# Altium project Carte_Alim_2020.PrjPcb
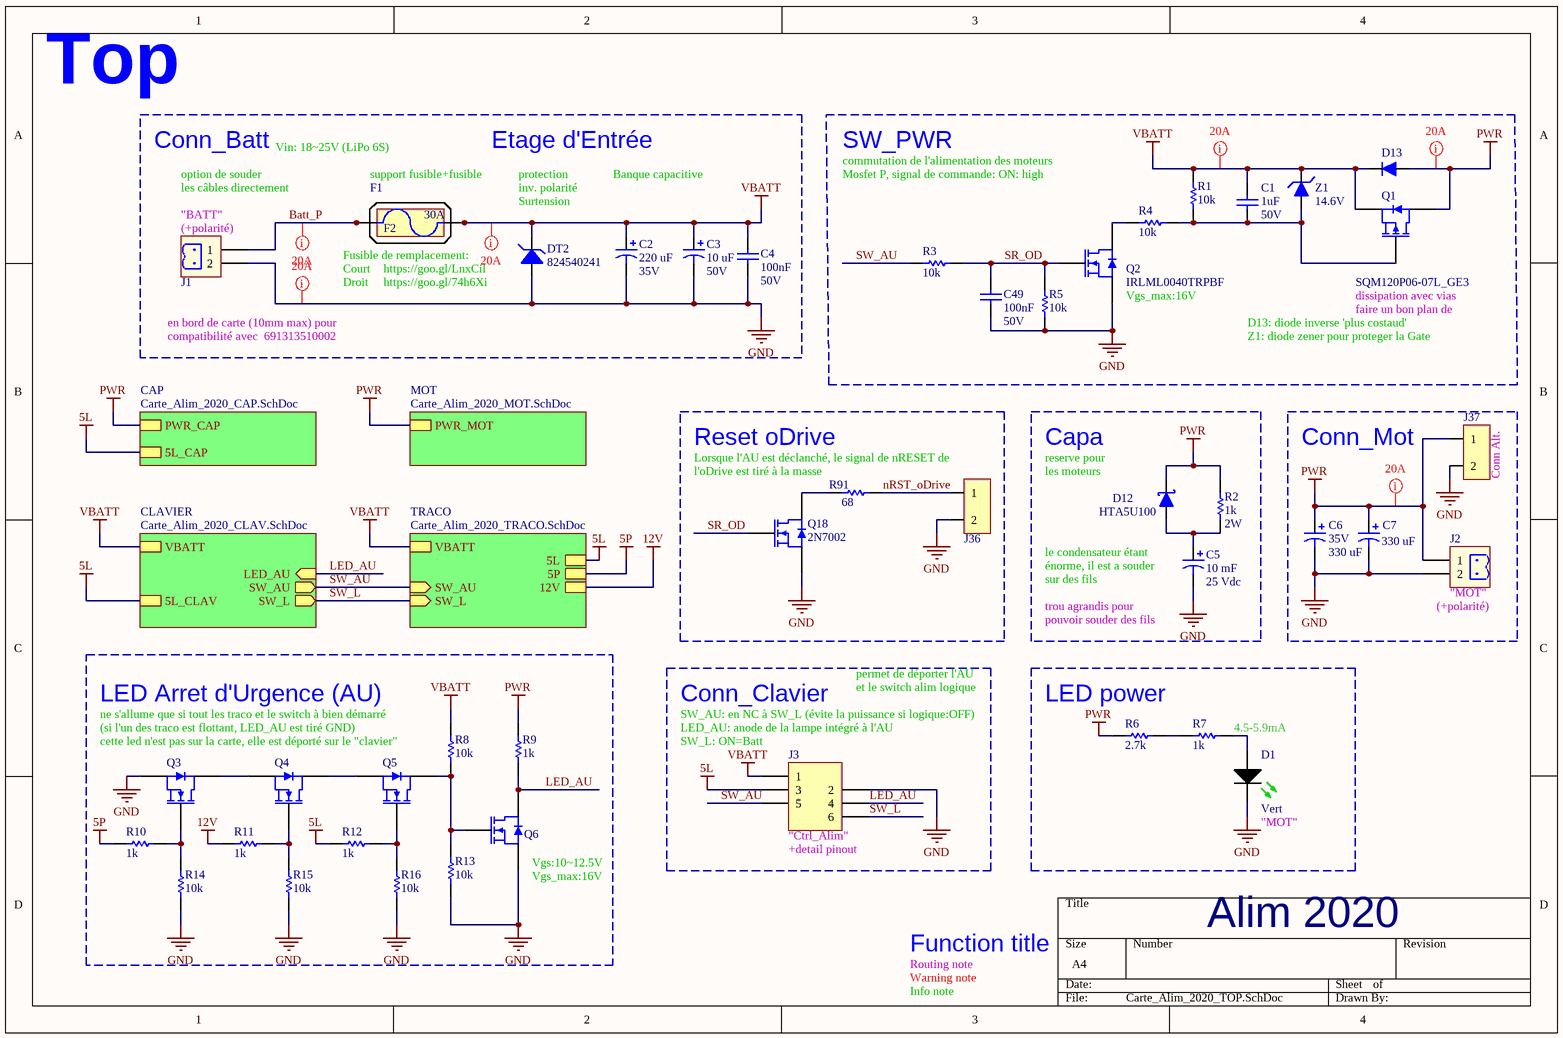
[diagram p0: Carte_Alim_2020_TOP.SchDoc]
3 sheets, 150 parts. Net scope: hierarchical (ports join the sheet entries above them; power ports are global).
Board file: Carte_Alim_2020.PcbDoc
Sheets:
  Carte_Alim_2020_TOP.SchDoc
    CAP = Carte_Alim_2020_CAP.SchDoc
    CLAVIER = Carte_Alim_2020_CLAV.SchDoc

## Sheet Carte_Alim_2020_TOP.SchDoc
size A4; Author: Audran; CompanyName: Goldorak; Address1: Electrolab; Address2: 52 rue Paul Lescop; Address3: 92000 Nanterre; DocumentNumber: 1; SheetNumber: 1; SheetTotal: 5; ProjectName: Cartes_2017

### Parts
C1  1uF  RatedVoltage: 50V  [WCAP-CSGP_0805, 2x1.25x1.25]
C2  220 uF  RatedVoltage: 35V  [WCAP-ATG8_8x11.5x3.5x0.5]
C3  10 uF  RatedVoltage: 50V  [WCAP-ATG8_5x11x2x0.5]
C4  100nF  RatedVoltage: 50V  [WCAP-CSGP_0603, 1.6x0.8x0.8]
C5  10 mF  Rated Voltage: 25 Vdc  [WCAP-ATG8_22x41x10x0.8]
C6  330 uF  RatedVoltage: 35V  [WCAP-ATG8_10x12.5x5x0.6]
C7  330 uF  [WCAP-ATG8_10x12.5x5x0.6]
C49  100nF  RatedVoltage: 50V  [WCAP-CSGP_0603, 1.6x0.8x0.8]
D1  Vert  [SMCW_0603]
D12  HTA5U100  [SMA Diode (DO-214AC)]
D13  RS3J R6  [DO-214AB_Unidirectional]  (value not drawn)
DT2  824540241  [DO-214AB_Unidirectional]
F1  3557-2  [3557-2]  (value not drawn)
F2  Courant nominal: 30A  (hidden comment: 0891030.NXS)  (mechanical)
J1  691311500102  [691311500102]  (value not drawn)
J2  691311500102  [691311500102]  (value not drawn)
J3  690367280676  [690367280676]  (value not drawn)
J36  22-03-2021  [22-03-2021]  (value not drawn)
J37  22-03-2021  [22-03-2021]  (value not drawn)
Q1  SQM120P06-07L_GE3  [TO-263]
Q2  IRLML0040TRPBF  [SOT-23]
Q3  IRLML0040TRPBF  [SOT-23]  (value not drawn)
Q4  IRLML0040TRPBF  [SOT-23]  (value not drawn)
Q5  IRLML0040TRPBF  [SOT-23]  (value not drawn)
Q6  IRLML0040TRPBF  [SOT-23]  (value not drawn)
Q18  2N7002  [SOT-23]
R1  value 10k  [RESC1608X06N]  (hidden comment: RC0603FR-0710KL)
R2  1k  Power: 2W  [RESADV480W80L1200D390]
R3  value 10k  [RESC1608X06N]  (hidden comment: RC0603FR-0710KL)
R4  value 10k  [RESC1608X06N]  (hidden comment: RC0603FR-0710KL)
R5  value 10k  [RESC1608X06N]  (hidden comment: RC0603FR-0710KL)
R6  value 2.7k  [RESC2012X06M]  (hidden comment: RC0805FR-072K7L)
R7  value 1k  [RESC1608X06N]  (hidden comment: RC0603FR-071KL)
R8  value 10k  [RESC1608X06N]  (hidden comment: RC0603FR-0710KL)
R9  value 1k  [RESC1608X06N]  (hidden comment: RC0603FR-071KL)
R10  value 1k  [RESC1608X06N]  (hidden comment: RC0603FR-071KL)
R11  value 1k  [RESC1608X06N]  (hidden comment: RC0603FR-071KL)
R12  value 1k  [RESC1608X06N]  (hidden comment: RC0603FR-071KL)
R13  value 10k  [RESC1608X06N]  (hidden comment: RC0603FR-0710KL)
R14  value 10k  [RESC1608X06N]  (hidden comment: RC0603FR-0710KL)
R15  value 10k  [RESC1608X06N]  (hidden comment: RC0603FR-0710KL)
R16  value 10k  [RESC1608X06N]  (hidden comment: RC0603FR-0710KL)
R91  value 68  [RESC1608X06N]  (hidden comment: RC0603FR-0768RL)
Z1  value 14.6V  [SOD-323]  (hidden comment: MM3Z15VST1G)

### Blocks framed on the sheet
SW_PWR: C1 C49 D13 Q1 Q2 R1 R3-R5 Z1
Reset oDrive: J36 Q18 R91
Capa: C5 D12 R2
Conn_Mot: C6 C7 J2 J37
LED Arret d'Urgence (AU): Q3-Q6 R8-R16
Conn_Clavier: J3
LED power: D1 R6 R7

### Sub-sheets
CAP = Carte_Alim_2020_CAP.SchDoc: PWR_CAP, 5L_CAP
CLAVIER = Carte_Alim_2020_CLAV.SchDoc: 5L_CLAV, VBATT, SW_L (out), LED_AU (in), SW_AU (out)
MOT = Carte_Alim_2020_MOT.SchDoc (file not in this document): PWR_MOT
TRACO = Carte_Alim_2020_TRACO.SchDoc (file not in this document): VBATT, 5L, 5P, 12V, SW_L (in), SW_AU (in)

### Nets
5L: J3.3 R12.2 ; sheet CAP/5L_CAP, sheet TRACO/5L, sheet CLAVIER/5L_CLAV
5P: R10.2 ; sheet TRACO/5P
12V: R11.2 ; sheet TRACO/12V
GND: C2.2 C3.2 C4.1 C5.2 C6.2 C7.2 C49.1 D1.1(C) DT2.1 J1.2 J2.2 J3.2 J36.2 J37.2 Q2.2(S) Q3.2(S) Q6.2(S) Q18.2(S) R5.2 R13.1 R14.1 R15.1 R16.1
PWR: C6.1 C7.1 D12.2 D13.1 J2.1 J37.1 Q1.4(D) R2.1 R6.1 R9.2 ; sheet CAP/PWR_CAP, sheet MOT/PWR_MOT
VBATT: C1.2 C2.1 C3.1 C4.2 D13.2 DT2.2 F1.2 F1.4 J3.1 Q1.3(S) R1.2 R8.2 Z1.2 ; sheet TRACO/VBATT, sheet CLAVIER/VBATT
Batt_P: F1.1 F1.3 J1.1
LED_AU: J3.4 Q6.3(D) R9.1 ; sheet CLAVIER/LED_AU
nRST_oDrive: J36.1 R91.2
SR_OD: C49.2 Q2.1(G) Q18.1(G) R3.2 R5.1
SW_AU: J3.5 R3.1 ; sheet TRACO/SW_AU, sheet CLAVIER/SW_AU
SW_L: J3.6 ; sheet TRACO/SW_L, sheet CLAVIER/SW_L
NetC1_1: C1.1 Q1.1(G) R1.1 R4.1 Z1.1
NetC5_1: C5.1 D12.1 R2.2
NetD1_2: D1.2(A) R7.1
NetQ2_3: Q2.3(D) R4.2
NetQ3_1: Q3.1(G) R10.1 R14.2
NetQ3_3: Q3.3(D) Q4.2(S)
NetQ4_1: Q4.1(G) R11.1 R15.2
NetQ4_3: Q4.3(D) Q5.2(S)
NetQ5_1: Q5.1(G) R12.1 R16.2
NetQ5_3: Q5.3(D) Q6.1(G) R8.1 R13.2
NetQ18_3: Q18.3(D) R91.1
NetR6_2: R6.2 R7.2

### Layout directives
net class PWR_20A: Batt_P, GND, PWR, VBATT

### Notes on the sheet
- Top
- Conn_Batt
- option de souder
- Vin: 18~25V (LiPo 6S)
- support fusible+fusible
- Etage d'Entrée
- protection
- Banque capacitive
- commutation de l'alimentation des moteurs
- Mosfet P, signal de commande: ON: high
- les câbles directement
- (near J1) "BATT"
- (near J1) (+polarité)
- inv. polarité
- Surtension
- Droit
- Court
- Fusible de remplacement:
- (near DT2) https://goo.gl/74h6Xi
- (near DT2) https://goo.gl/LnxCil
- (near Q2) Vgs_max:16V
- faire un bon plan de
- dissipation avec vias
- compatibilité avec  691313510002
- en bord de carte (10mm max) pour
- D13: diode inverse 'plus costaud'
- Z1: diode zener pour proteger la Gate
- Lorsque l'AU est déclanché, le signal de nRESET de
- (near R91) l'oDrive est tiré à la masse
- reserve pour
- les moteurs
- (near J37) Conn Alt.
- (near C5) le condensateur étant
- (near C5) énorme, il est a souder
- sur des fils
- (near C5) trou agrandis pour
- (near C5) pouvoir souder des fils
- (near J2) (+polarité)
- (near J2) "MOT"
- (near R8) ne s'allume que si tout les traco et le switch à bien démarré
- SW_AU: en NC à SW_L (évite la puissance si logique:OFF)
- permet de déporter l'AU
- et le switch alim logique
- (si l'un des traco est flottant, LED_AU est tiré GND)
- (near R8) cette led n'est pas sur la carte, elle est déporté sur le "clavier"
- (near J3) LED_AU: anode de la lampe intégré à l'AU
- (near J3) SW_L: ON=Batt
- (near R7) 4.5-5.9mA
- (near J3) "Ctrl_Alim"
- (near J3) +detail pinout
- (near D1) "MOT"
- (near Q6) Vgs_max:16V
- (near Q6) Vgs:10~12.5V
- Routing note
- Warning note
- Function title
- Alim 2020
- Info note

### Library data of the parts
C1 = WCAP-CSGP, 885012207103: CAP CER 1uF 50V X7R 0805; Manufacturer: Wurth Elektronik; PublishedDate: Aug 2016; ComponentLink1Description: Manufacturer; ComponentLink1URL: http://www.we-online.de; ComponentLink2Description: Datasheet; ComponentLink2URL: http://katalog.we-online.com/pbs/datasheet/885012207103.pdf; Manufacturer Part Number: 885012207103; Value: 1uF; Size: 0805; CeramicType: X7R
C2 = WCAP-ATG8, 860010574011: CAP Alu 220 UF 20% 35 V; Manufacturer: Wurth Elektronik; PublishedDate: July 2016; ComponentLink1Description: Manufacturer; ComponentLink1URL: http://www.we-online.de; ComponentLink2Description: Datasheet; ComponentLink2URL: http://katalog.we-online.de/pbs/datasheet/860010574011.pdf; Manufacturer Part Number: 860010574011; Value: 220 uF; Size: 8mmx11.5mm
C3 = WCAP-ATG8, 860010672009: CAP Alu 10 UF 20% 50 V; Manufacturer: Wurth Elektronik; PublishedDate: July 2016; ComponentLink1Description: Manufacturer; ComponentLink1URL: http://www.we-online.de; ComponentLink2Description: Datasheet; ComponentLink2URL: http://katalog.we-online.de/pbs/datasheet/860010672009.pdf; Value: 10 uF; Size: 5mmx11mm; Manufacturer Part Number: 860010672009
C4 C49 = WCAP-CSGP, 885012206095: CAP CER 100nF 50V X7R 0603; Manufacturer: Wurth Elektronik; PublishedDate: Aug 2016; ComponentLink1Description: Manufacturer; ComponentLink1URL: http://www.we-online.de; ComponentLink2Description: Datasheet; ComponentLink2URL: http://katalog.we-online.com/pbs/datasheet/885012206095.pdf; Value: 100nF; Size: 0603; CeramicType: X7R; Manufacturer Part Number: 885012206095
C5 = WCAP-ATG8, 860010483029: CAP Alu 10'000 UF 25 V; Manufacturer: Wurth Elektronik; ComponentLink1Description: Manufacturer; ComponentLink1URL: http://www.we-online.de; ComponentLink2Description: Datasheet; ComponentLink2URL: http://katalog.we-online.de/pbs/datasheet/860010483029.pdf; Manufacturer Part Number: 860010483029; Published Date: Sep. 2017; Size: 22x41mm; Value: 10 mF
C6 = WCAP-ATG8, 860010575012: CAP Alu 330 UF 20% 35 V; Manufacturer: Wurth Elektronik; PublishedDate: July 2016; ComponentLink1Description: Manufacturer; ComponentLink1URL: http://www.we-online.de; ComponentLink2Description: Datasheet; ComponentLink2URL: http://katalog.we-online.de/pbs/datasheet/860010575012.pdf; Manufacturer Part Number: 860010575012; Value: 330 uF; Size: 10mmx12.5mm
C7 = WCAP-ATG8, 860010575012: CAP Alu 330 UF 20% 35 V; Manufacturer: Wurth Elektronik; RatedVoltage: 35V; PublishedDate: July 2016; ComponentLink1Description: Manufacturer; ComponentLink1URL: http://www.we-online.de; ComponentLink2Description: Datasheet; ComponentLink2URL: http://katalog.we-online.de/pbs/datasheet/860010575012.pdf; Manufacturer Part Number: 860010575012; Value: 330 uF; Size: 10mmx12.5mm
D1 = WL-SMCW 0603  150060GS75000: SMD mono-color Chip LED, WL-SMCW, Green; Manufacturer 1: Würth Elektronik eiSos GmbH; Manufacturer Part Number: 150060GS75000; ComponentLink1Description: Manufacturer; ComponentLink1URL: http://www.we-online.de; Created by: Christin Otto; Created Date: June 2013; ComponentLink2Description: Datasheet; ComponentLink2URL: http://katalog.we-online.com/led/datasheet/150060GS75000.pdf; Color: Green; Value: Vert; Supplier 1: Farnell; Supplier Part Number 1: 2322070
D12 = HTA5U100: DIODE SCHOTTKY 100V 5A SMA (DO-214AC); Manufacturer: MULTICOMP; ContinuousForwardCurrent: 5A (Pk 50A); Supplier 1: Farnell; Manufacturer Part Number: HTA5U100; ComponentLink1Description: Manufacturer; Supplier Part Number 1: 2750942; ComponentLink2Description: Datasheet; ComponentLink2URL: http://www.farnell.com/datasheets/2282884.pdf; ReverseVoltage: 100V; Type: Schottky
D13 = RS3J_R6: DIODE GEN PURP 600V 3A SMC; Manufacturer: TAIWAN SEMICONDUCTOR; Type: Standard; Manufacturer Part Number: RS3J R6; ComponentLink2Description: Datasheet; ComponentLink2URL: http://www.farnell.com/datasheets/2182655.pdf; ContinuousForwardCurrent: 3A; ReverseVoltage: 600V; Supplier 1: Farnell; Supplier Part Number 1: 2677388
DT2 = 824540241: WE-TVSP Power TVS Diode, Unidirectional, 1500 W, 24 VDC; Manufacturer: Wurth Electronics Inc.; Supplier 1: Farnell; Supplier Part Number 1: 2536699; Manufacturer Part Number: 824540241; ComponentLink1URL: http://katalog.we-online.de/pbs/datasheet/824540241.pdf; ComponentLink1Description: Datasheet
F1 = 3557-2: FUSE Holder 500V 30A PCB; Manufacturer: Keystone Electronics; Supplier 1: Farnell; Supplier Part Number 1: 2292904; Manufacturer Part Number: 3557-2; ComponentLink1URL: http://www.keyelco.com/product-pdf.cfm?p=296; ComponentLink1Description: Datasheet; Courant nominal: 30A
F2 = 0891030.NXS: FUSE AUTO 30A 58VDC BLADE MINI; Manufacturer: Littelfuse Inc.; Manufacturer Part Number: 0891030.NXS; Supplier 1: Digi-Key; Supplier Part Number 1: F4993-ND; ComponentLink1URL: http://www.littelfuse.com/~/media/automotive/datasheets/fuses/passenger-car-and-commercial-vehicle/blade-fuses/littelfuse_lowprofilemini_datasheet.pdf; ComponentLink1Description: Datasheet
J1 J2 = 691311500102: WR-TBL 2p Series 311 - 5.08 mm Closed Vertical PCB Header; Manufacturer: Wurth Electronics Inc.; Value: 2; Manufacturer Part Number: 691311500102; ComponentLink1Description: Datasheet; ComponentLink1URL: https://katalog.we-online.de/em/datasheet/6913115001xx.pdf; Supplier 1: Farnell; Supplier Part Number 1: 1641978
J3 = 690367280676: WR-MM 6p Female SMT Connector with Polarization; Manufacturer: Wurth Electronics Inc.; Value: 6; ComponentLink1Description: Datasheet; ComponentLink1URL: http://katalog.we-online.de/em/datasheet/69036728xx76.pdf; Manufacturer Part Number: 690367280676; Supplier 1: Farnell; Supplier Part Number 1: 1641849
J36 J37 = 22-03-2021: Manufacturer 1: MOLEX; Supplier 1: Farnell; Supplier Part Number 1: 9731075; Manufacturer Part Number: 22-03-2021; Pricing: 10=0.189, 100=0.147, 200=0.119, 500=0.108, 1000=0.088, 2500=0.08, 2500=0.0711, 20000=0.064 (EUR); ComponentLink1URL: http://www.farnell.com/cad/1533907.pdf; ComponentLink1Description: http://www.farnell.com/cad/1533907.pdf; ComponentLink2URL: http://www.farnell.com/datasheets/1791308.pdf; ComponentLink2Description: http://www.farnell.com/datasheets/1791308.pdf
Q1 = SQM120P06-07L_GE3: MOSFET P 60V 120A D2PAK; Manufacturer: VISHAY; Supplier 1: Farnell; Supplier Part Number 1: 2617099; Manufacturer Part Number: SQM120P06-07L_GE3; ComponentLink1Description: Datasheet; ComponentLink1URL: http://www.vishay.com/docs/67026/sqm120p0.pdf
Q2-Q6 = IRLML0040: MOSFET N 40V 3.6A SOT23; Manufacturer: INTERNATIONAL RECTIFIER; Supplier 1: Farnell; Supplier Part Number 1: 1831088; Manufacturer Part Number: IRLML0040TRPBF; ComponentLink1Description: http://www.irf.com/product-info/datasheets/data/irlml0040pbf.pdf; ComponentLink1URL: http://www.irf.com/product-info/datasheets/data/irlml0040pbf.pdf
Q18 = 2N7002: MOSFET N 60V 115MA SOT-23; Manufacturer: Changjiang Electronics Tech (CJ); Manufacturer Part Number: 2N7002; ComponentLink1Description: Datasheet; ComponentLink1URL: https://datasheet.lcsc.com/szlcsc/1810151612_Changjiang-Electronics-Tech-CJ-2N7002_C8545.pdf; Supplier 2: JLCPCB; Supplier Part Number 2: C8545; Supplier 1: Farnell; Supplier Part Number 1: 1510761
R1 R3-R5 R8 R13-R16 = RC0603FR-0710KL: RES SMD 10K OHM 1% 1/10W 0603; Manufacturer: Yageo; Power: 100mW; Vmax: 50V; Manufacturer Part Number: RC0603FR-0710KL; Type: Thick Film; ComponentLink1Description: Manufacturer; ComponentLink1URL: http://www.yageo.com/NewPortal/_en/index.jsp; ComponentLink2Description: Datasheet; ComponentLink2URL: http://www.farnell.com/datasheets/2167052.pdf; Supplier 1: Farnell; Supplier Part Number 1: 9238603; Precision: ±1%
R2 = Generic_TH_Vert_Res: resistance traversante verticale générique; Manufacturer: MULTICOMP; Manufacturer Part Number: MCKNP02WJ0102A19; Precision: ±5%; Type: Through Hole; Supplier 1: Farnell; Supplier Part Number 1: 1903754; Value: 1k
R6 = RC0805FR-072K7L: RES SMD 2K7 OHM 1% 1/8W 0805; Manufacturer: Yageo; Power: 125mW; Vmax: 50V; Manufacturer Part Number: RC0805FR-072K7L; Type: Thick Film; ComponentLink1Description: Manufacturer; ComponentLink1URL: http://www.yageo.com/NewPortal/_en/index.jsp; ComponentLink2Description: Datasheet; ComponentLink2URL: http://www.farnell.com/datasheets/444164.pdf; Supplier 1: Farnell; Supplier Part Number 1: 9237666; Precision: ±1%
R7 R9-R12 = RC0603FR-071KL: RES SMD 1K OHM 1% 1/10W 0603; Manufacturer: Yageo; Power: 100mW; Vmax: 50V; Manufacturer Part Number: RC0603FR-071KL; Type: Thick Film; ComponentLink1Description: Manufacturer; ComponentLink1URL: http://www.yageo.com/NewPortal/_en/index.jsp; ComponentLink2Description: Datasheet; ComponentLink2URL: http://www.farnell.com/datasheets/2167052.pdf; Precision: ±1%; Supplier 1: Farnell; Supplier Part Number 1: 9238484
R91 = RC0603FR-0768RL: RES SMD 68 OHM 1% 1/10W 0603; Manufacturer: Yageo; Power: 100mW; Vmax: 50V; Manufacturer Part Number: RC0603FR-0768RL; Type: Thick Film; ComponentLink1Description: Manufacturer; ComponentLink1URL: http://www.yageo.com/NewPortal/_en/index.jsp; ComponentLink2Description: Datasheet; ComponentLink2URL: http://www.farnell.com/datasheets/1868787.pdf; Supplier 1: Farnell; Supplier Part Number 1: 9238344; Precision: ±1%
Z1 = MM3Z15VST1G: DIODE ZENER 14.6V 300mW SOD323; Manufacturer: ON Semiconductor; Manufacturer Part Number: MM3Z15VST1G; ComponentLink1URL: http://www.farnell.com/datasheets/2028649.pdf; ComponentLink1Description: Datasheet; Supplier 1: Farnell; Supplier Part Number 1: 2533369

## Sheet Carte_Alim_2020_CAP.SchDoc
size A4; Author: Audran; CompanyName: Goldorak; Address1: Electrolab; Address2: 52 rue Paul Lescop; Address3: 92000 Nanterre; DocumentNumber: 4; SheetNumber: 4; SheetTotal: 5; ProjectName: Cartes_2017
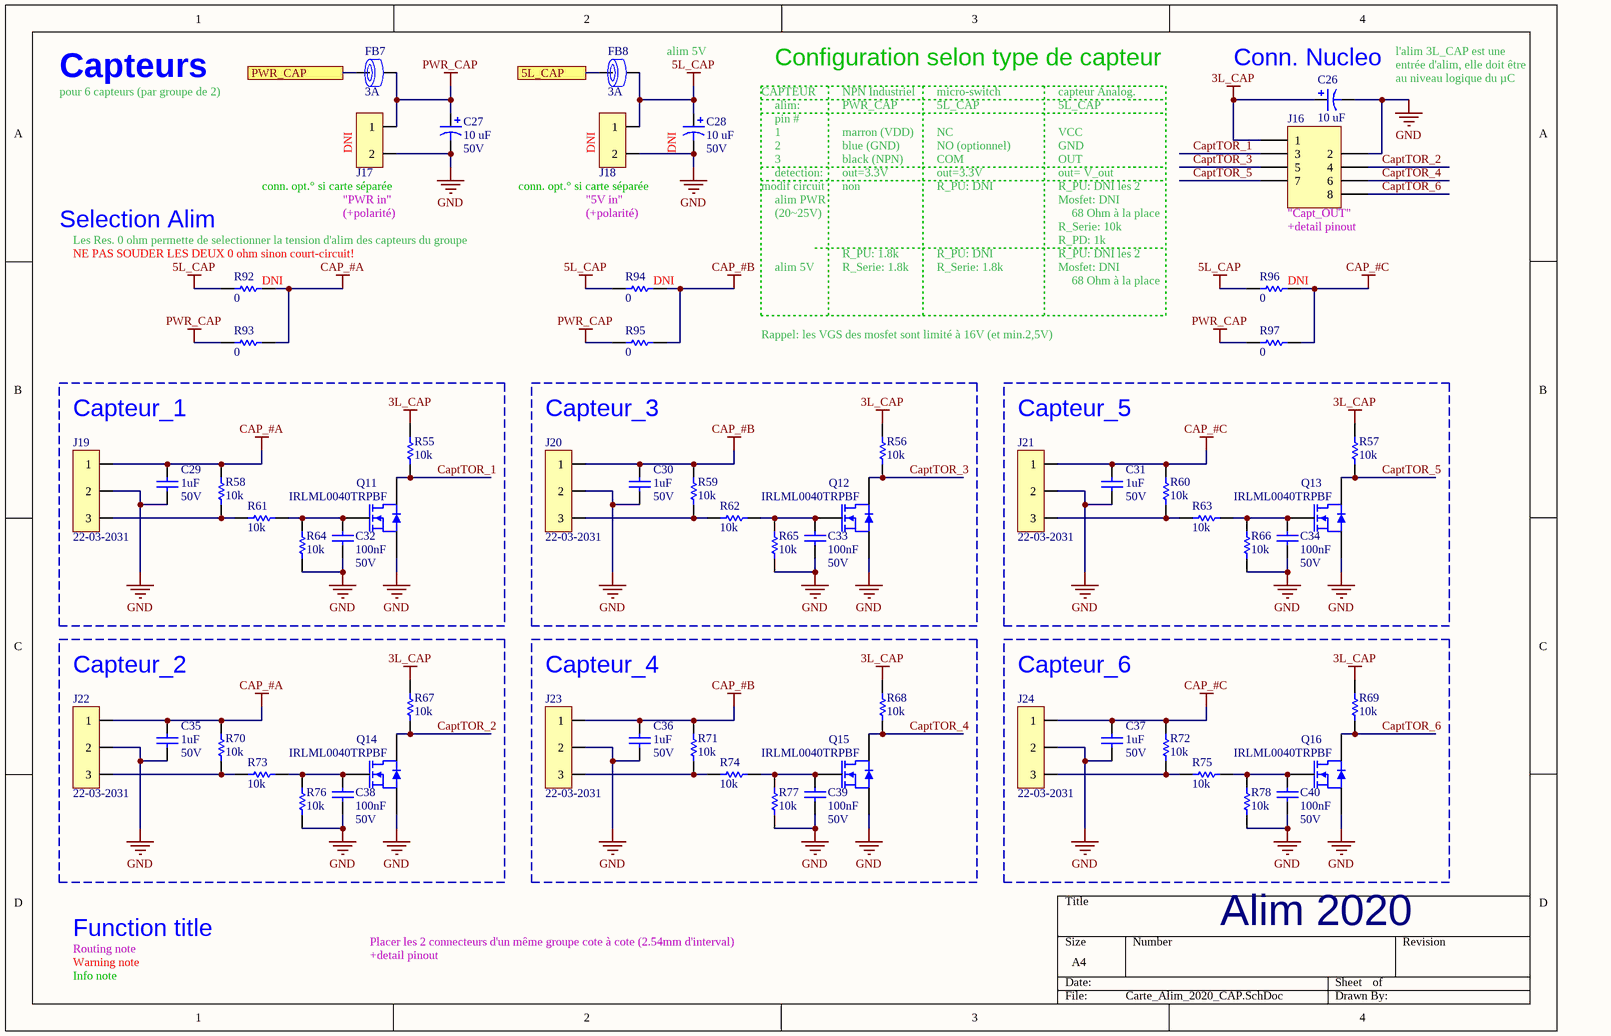
[diagram p1: Carte_Alim_2020_CAP.SchDoc]

### Parts
C26  10 uF  [WCAP-ATG8_5x11x2x0.5]
C27  10 uF  RatedVoltage: 50V  [WCAP-ATG8_5x11x2x0.5]
C28  10 uF  RatedVoltage: 50V  [WCAP-ATG8_5x11x2x0.5]
C29  1uF  RatedVoltage: 50V  [WCAP-CSGP_0805, 2x1.25x1.25]
C30  1uF  RatedVoltage: 50V  [WCAP-CSGP_0805, 2x1.25x1.25]
C31  1uF  RatedVoltage: 50V  [WCAP-CSGP_0805, 2x1.25x1.25]
C32  100nF  RatedVoltage: 50V  [WCAP-CSGP_0603, 1.6x0.8x0.8]
C33  100nF  RatedVoltage: 50V  [WCAP-CSGP_0603, 1.6x0.8x0.8]
C34  100nF  RatedVoltage: 50V  [WCAP-CSGP_0603, 1.6x0.8x0.8]
C35  1uF  RatedVoltage: 50V  [WCAP-CSGP_0805, 2x1.25x1.25]
C36  1uF  RatedVoltage: 50V  [WCAP-CSGP_0805, 2x1.25x1.25]
C37  1uF  RatedVoltage: 50V  [WCAP-CSGP_0805, 2x1.25x1.25]
C38  100nF  RatedVoltage: 50V  [WCAP-CSGP_0603, 1.6x0.8x0.8]
C39  100nF  RatedVoltage: 50V  [WCAP-CSGP_0603, 1.6x0.8x0.8]
C40  100nF  RatedVoltage: 50V  [WCAP-CSGP_0603, 1.6x0.8x0.8]
FB7  RatedCurrent: 3A  [WE-CBF_0805_High Current]  (hidden comment: 742792023)
FB8  RatedCurrent: 3A  [WE-CBF_0805_High Current]  (hidden comment: 742792023)
J16  690367280876  [690367280876]  (value not drawn)
J17  22-03-2021  [22-03-2021]  (value not drawn)
J18  22-03-2021  [22-03-2021]  (value not drawn)
J19  22-03-2031  [22-03-2031]
J20  22-03-2031  [22-03-2031]
J21  22-03-2031  [22-03-2031]
J22  22-03-2031  [22-03-2031]
J23  22-03-2031  [22-03-2031]
J24  22-03-2031  [22-03-2031]
Q11  IRLML0040TRPBF  [SOT-23]
Q12  IRLML0040TRPBF  [SOT-23]
Q13  IRLML0040TRPBF  [SOT-23]
Q14  IRLML0040TRPBF  [SOT-23]
Q15  IRLML0040TRPBF  [SOT-23]
Q16  IRLML0040TRPBF  [SOT-23]
R55  value 10k  [RESC1608X06N]  (hidden comment: RC0603FR-0710KL)
R56  value 10k  [RESC1608X06N]  (hidden comment: RC0603FR-0710KL)
R57  value 10k  [RESC1608X06N]  (hidden comment: RC0603FR-0710KL)
R58  value 10k  [RESC1608X06N]  (hidden comment: RC0603FR-0710KL)
R59  value 10k  [RESC1608X06N]  (hidden comment: RC0603FR-0710KL)
R60  value 10k  [RESC1608X06N]  (hidden comment: RC0603FR-0710KL)
R61  value 10k  [RESC1608X06N]  (hidden comment: RC0603FR-0710KL)
R62  value 10k  [RESC1608X06N]  (hidden comment: RC0603FR-0710KL)
R63  value 10k  [RESC1608X06N]  (hidden comment: RC0603FR-0710KL)
R64  value 10k  [RESC1608X06N]  (hidden comment: RC0603FR-0710KL)
R65  value 10k  [RESC1608X06N]  (hidden comment: RC0603FR-0710KL)
R66  value 10k  [RESC1608X06N]  (hidden comment: RC0603FR-0710KL)
R67  value 10k  [RESC1608X06N]  (hidden comment: RC0603FR-0710KL)
R68  value 10k  [RESC1608X06N]  (hidden comment: RC0603FR-0710KL)
R69  value 10k  [RESC1608X06N]  (hidden comment: RC0603FR-0710KL)
R70  value 10k  [RESC1608X06N]  (hidden comment: RC0603FR-0710KL)
R71  value 10k  [RESC1608X06N]  (hidden comment: RC0603FR-0710KL)
R72  value 10k  [RESC1608X06N]  (hidden comment: RC0603FR-0710KL)
R73  value 10k  [RESC1608X06N]  (hidden comment: RC0603FR-0710KL)
R74  value 10k  [RESC1608X06N]  (hidden comment: RC0603FR-0710KL)
R75  value 10k  [RESC1608X06N]  (hidden comment: RC0603FR-0710KL)
R76  value 10k  [RESC1608X06N]  (hidden comment: RC0603FR-0710KL)
R77  value 10k  [RESC1608X06N]  (hidden comment: RC0603FR-0710KL)
R78  value 10k  [RESC1608X06N]  (hidden comment: RC0603FR-0710KL)
R92  value 0  [RESC1608X06N]  (hidden comment: RC0603FR-070RL)
R93  value 0  [RESC1608X06N]  (hidden comment: RC0603FR-070RL)
R94  value 0  [RESC1608X06N]  (hidden comment: RC0603FR-070RL)
R95  value 0  [RESC1608X06N]  (hidden comment: RC0603FR-070RL)
R96  value 0  [RESC1608X06N]  (hidden comment: RC0603FR-070RL)
R97  value 0  [RESC1608X06N]  (hidden comment: RC0603FR-070RL)

### Blocks framed on the sheet
Capteur_1: C29 C32 J19 Q11 R55 R58 R61 R64
Capteur_3: C30 C33 J20 Q12 R56 R59 R62 R65
Capteur_5: C31 C34 J21 Q13 R57 R60 R63 R66
Capteur_2: C35 C38 J22 Q14 R67 R70 R73 R76
Capteur_4: C36 C39 J23 Q15 R68 R71 R74 R77
Capteur_6: C37 C40 J24 Q16 R69 R72 R75 R78

### Ports
5L_CAP, PWR_CAP

### Nets
3L_CAP: C26.1 J16.1 R55.2 R56.2 R57.2 R67.2 R68.2 R69.2
5L: FB8.1 ; port 5L_CAP
5L_CAP: C28.1 FB8.2 J18.1 R92.1 R94.1 R96.1
CAP_#A: C29.2 C35.2 J19.1 J22.1 R58.2 R70.2 R92.2 R93.2
CAP_#B: C30.2 C36.2 J20.1 J23.1 R59.2 R71.2 R94.2 R95.2
CAP_#C: C31.2 C37.2 J21.1 J24.1 R60.2 R72.2 R96.2 R97.2
GND: C26.2 C27.2 C28.2 C29.1 C30.1 C31.1 C32.2 C33.2 C34.2 C35.1 C36.1 C37.1 C38.2 C39.2 C40.2 J16.2 J17.2 J18.2 J19.2 J20.2 J21.2 J22.2 J23.2 J24.2 Q11.2(S) Q12.2(S) Q13.2(S) Q14.2(S) Q15.2(S) Q16.2(S) R64.1 R65.1 R66.1 R76.1 R77.1 R78.1
PWR: FB7.1 ; port PWR_CAP
PWR_CAP: C27.1 FB7.2 J17.1 R93.1 R95.1 R97.1
CaptTOR_1: J16.3 Q11.3(D) R55.1
CaptTOR_2: J16.4 Q14.3(D) R67.1
CaptTOR_3: J16.5 Q12.3(D) R56.1
CaptTOR_4: J16.6 Q15.3(D) R68.1
CaptTOR_5: J16.7 Q13.3(D) R57.1
CaptTOR_6: J16.8 Q16.3(D) R69.1
NetC32_1: C32.1 Q11.1(G) R61.2 R64.2
NetC33_1: C33.1 Q12.1(G) R62.2 R65.2
NetC34_1: C34.1 Q13.1(G) R63.2 R66.2
NetC38_1: C38.1 Q14.1(G) R73.2 R76.2
NetC39_1: C39.1 Q15.1(G) R74.2 R77.2
NetC40_1: C40.1 Q16.1(G) R75.2 R78.2
NetJ19_3: J19.3 R58.1 R61.1
NetJ20_3: J20.3 R59.1 R62.1
NetJ21_3: J21.3 R60.1 R63.1
NetJ22_3: J22.3 R70.1 R73.1
NetJ23_3: J23.3 R71.1 R74.1
NetJ24_3: J24.3 R72.1 R75.1

### Notes on the sheet
- Capteurs
- pour 6 capteurs (par groupe de 2)
- alim 5V
- CAPTEUR
- alim:
- Configuration selon type de capteur
- NPN Industriel
- PWR_CAP
- micro-switch
- 5L_CAP
- capteur Analog.
- (near C26) Conn. Nucleo
- l'alim 3L_CAP est une
- au niveau logique du µC
- entrée d'alim, elle doit être
- (near J17) DNI
- (near J18) DNI
- (near C28) DNI
- pin #
- 1
- 2
- 3
- detection:
- marron (VDD)
- blue (GND)
- black (NPN)
- out=3.3V
- NC
- NO (optionnel)
- COM
- VCC
- OUT
- GND
- out= V_out
- Selection Alim
- (near R92) Les Res. 0 ohm permette de selectionner la tension d'alim des capteurs du groupe
- (near J17) conn. opt.° si carte séparée
- (near J17) "PWR in"
- (+polarité)
- conn. opt.° si carte séparée
- (near J18) "5V in"
- modif circuit
- alim PWR
- (20~25V)
- non
- R_PU: DNI
- R_PU: DNI les 2
- Mosfet: DNI
- R_Serie: 10k
- R_PD: 1k
- 68 Ohm à la place
- (near J16) "Capt_OUT"
- (near J16) +detail pinout
- (near R92) NE PAS SOUDER LES DEUX 0 ohm sinon court-circuit!
- (near R92) DNI
- (near R94) DNI
- R_PU: 1.8k
- R_Serie: 1.8k
- (near R96) DNI
- Rappel: les VGS des mosfet sont limité à 16V (et min.2,5V)
- Routing note
- Warning note
- Info note
- Function title
- Placer les 2 connecteurs d'un même groupe cote à cote (2.54mm d'interval)
- +detail pinout
- Alim 2020

### Library data of the parts
C26 = WCAP-ATG8, 860010672009: CAP Alu 10 UF 20% 50 V; Manufacturer: Wurth Elektronik; RatedVoltage: 50V; PublishedDate: July 2016; ComponentLink1Description: Manufacturer; ComponentLink1URL: http://www.we-online.de; ComponentLink2Description: Datasheet; ComponentLink2URL: http://katalog.we-online.de/pbs/datasheet/860010672009.pdf; Value: 10 uF; Size: 5mmx11mm; Manufacturer Part Number: 860010672009
C27 C28 = WCAP-ATG8, 860010672009: as C3 on sheet Carte_Alim_2020_TOP; PublishedDate: July 2016; ComponentLink1Description: Manufacturer; ComponentLink1URL: http://www.we-online.de; ComponentLink2Description: Datasheet; ComponentLink2URL: http://katalog.we-online.de/pbs/datasheet/860010672009.pdf; Value: 10 uF; Size: 5mmx11mm; Manufacturer Part Number: 860010672009
C29-C31 C35-C37 = WCAP-CSGP, 885012207103: as C1 on sheet Carte_Alim_2020_TOP; PublishedDate: Aug 2016; ComponentLink1Description: Manufacturer; ComponentLink1URL: http://www.we-online.de; ComponentLink2Description: Datasheet; ComponentLink2URL: http://katalog.we-online.com/pbs/datasheet/885012207103.pdf; Manufacturer Part Number: 885012207103; Value: 1uF; Size: 0805; CeramicType: X7R
C32-C34 C38-C40 = WCAP-CSGP, 885012206095: as C4 on sheet Carte_Alim_2020_TOP; PublishedDate: Aug 2016; ComponentLink1Description: Manufacturer; ComponentLink1URL: http://www.we-online.de; ComponentLink2Description: Datasheet; ComponentLink2URL: http://katalog.we-online.com/pbs/datasheet/885012206095.pdf; Value: 100nF; Size: 0603; CeramicType: X7R; Manufacturer Part Number: 885012206095
FB7 FB8 = WE-CBF, 742792023: Ferrite Bead 120ohm 0805 3A; Manufacturer: Wurth Elektronik; Value: 120Ω; ComponentLink1Description: Manufacturer; ComponentLink1URL: https://www.we-online.com/catalog/en/WE-CBF/?sq=742792023#742792023; ComponentLink2Description: Datasheet; ComponentLink2URL: https://www.we-online.com/catalog/datasheet/742792023.pdf; Manufacturer Part Number: 742792023; Supplier 2: JLCPCB; Supplier Part Number 2: C1015; Supplier 1: Farnell; Supplier Part Number 1: 1635732
J16 = 690367280876: WR-MM 8p Female SMT Connector with Polarization; Manufacturer: Wurth Electronics Inc.; Value: 8; Manufacturer Part Number: 690367280876; ComponentLink1Description: Datasheet; ComponentLink1URL: http://katalog.we-online.de/em/datasheet/69036728xx76.pdf; Supplier 1: Farnell; Supplier Part Number 1: 1641850
J17 J18 = 22-03-2021: Manufacturer 1: MOLEX; Supplier 1: Farnell; Supplier Part Number 1: 9731075; Manufacturer Part Number: 22-03-2021; Pricing: 10=0.189, 100=0.147, 200=0.119, 500=0.108, 1000=0.088, 2500=0.08, 2500=0.0711, 20000=0.064 (EUR); ComponentLink1URL: http://www.farnell.com/cad/1533907.pdf; ComponentLink1Description: http://www.farnell.com/cad/1533907.pdf; ComponentLink2URL: http://www.farnell.com/datasheets/1791308.pdf; ComponentLink2Description: http://www.farnell.com/datasheets/1791308.pdf
J19-J24 = 22-03-2031: Manufacturer 1: MOLEX; Supplier 1: Farnell; Supplier Part Number 1: 9731083; Manufacturer Part Number: 22-03-2031; Pricing: 10=0.27, 100=0.242, 200=0.22, 500=0.208, 1000=0.202, 2500=0.196 (EUR); ComponentLink1URL: http://www.farnell.com/cad/1533907.pdf; ComponentLink1Description: http://www.farnell.com/cad/1533907.pdf; ComponentLink2URL: http://www.farnell.com/datasheets/1785732.pdf; ComponentLink2Description: http://www.farnell.com/datasheets/1785732.pdf
Q11-Q16 = IRLML0040: as Q2 on sheet Carte_Alim_2020_TOP; Supplier 1: Farnell; Supplier Part Number 1: 1831088; Manufacturer Part Number: IRLML0040TRPBF; ComponentLink1Description: http://www.irf.com/product-info/datasheets/data/irlml0040pbf.pdf; ComponentLink1URL: http://www.irf.com/product-info/datasheets/data/irlml0040pbf.pdf
R55-R78 = RC0603FR-0710KL: as R1 on sheet Carte_Alim_2020_TOP; Manufacturer Part Number: RC0603FR-0710KL; Type: Thick Film; ComponentLink1Description: Manufacturer; ComponentLink1URL: http://www.yageo.com/NewPortal/_en/index.jsp; ComponentLink2Description: Datasheet; ComponentLink2URL: http://www.farnell.com/datasheets/2167052.pdf; Supplier 1: Farnell; Supplier Part Number 1: 9238603; Precision: ±1%
R92-R97 = RC0603FR-070RL: RES SMD 0 OHM 1% 1/10W 0603; Manufacturer: Yageo; Power: 100mW; Vmax: 50V; Manufacturer Part Number: RC0603FR-070RL; Type: Thick Film; ComponentLink1Description: Manufacturer; ComponentLink1URL: http://www.yageo.com/NewPortal/_en/index.jsp; ComponentLink2Description: Datasheet; ComponentLink2URL: http://www.farnell.com/datasheets/2167052.pdf; Supplier 1: Farnell; Precision: ±1%; Supplier Part Number 1: 2309106; Supplier 2: JLCPCB; Supplier Part Number 2: C21189

## Sheet Carte_Alim_2020_CLAV.SchDoc
size A4; Author: Audran; CompanyName: Goldorak; Address1: Electrolab; Address2: 52 rue Paul Lescop; Address3: 92000 Nanterre; DocumentNumber: 5; SheetNumber: 5; SheetTotal: 5; ProjectName: Cartes_2017
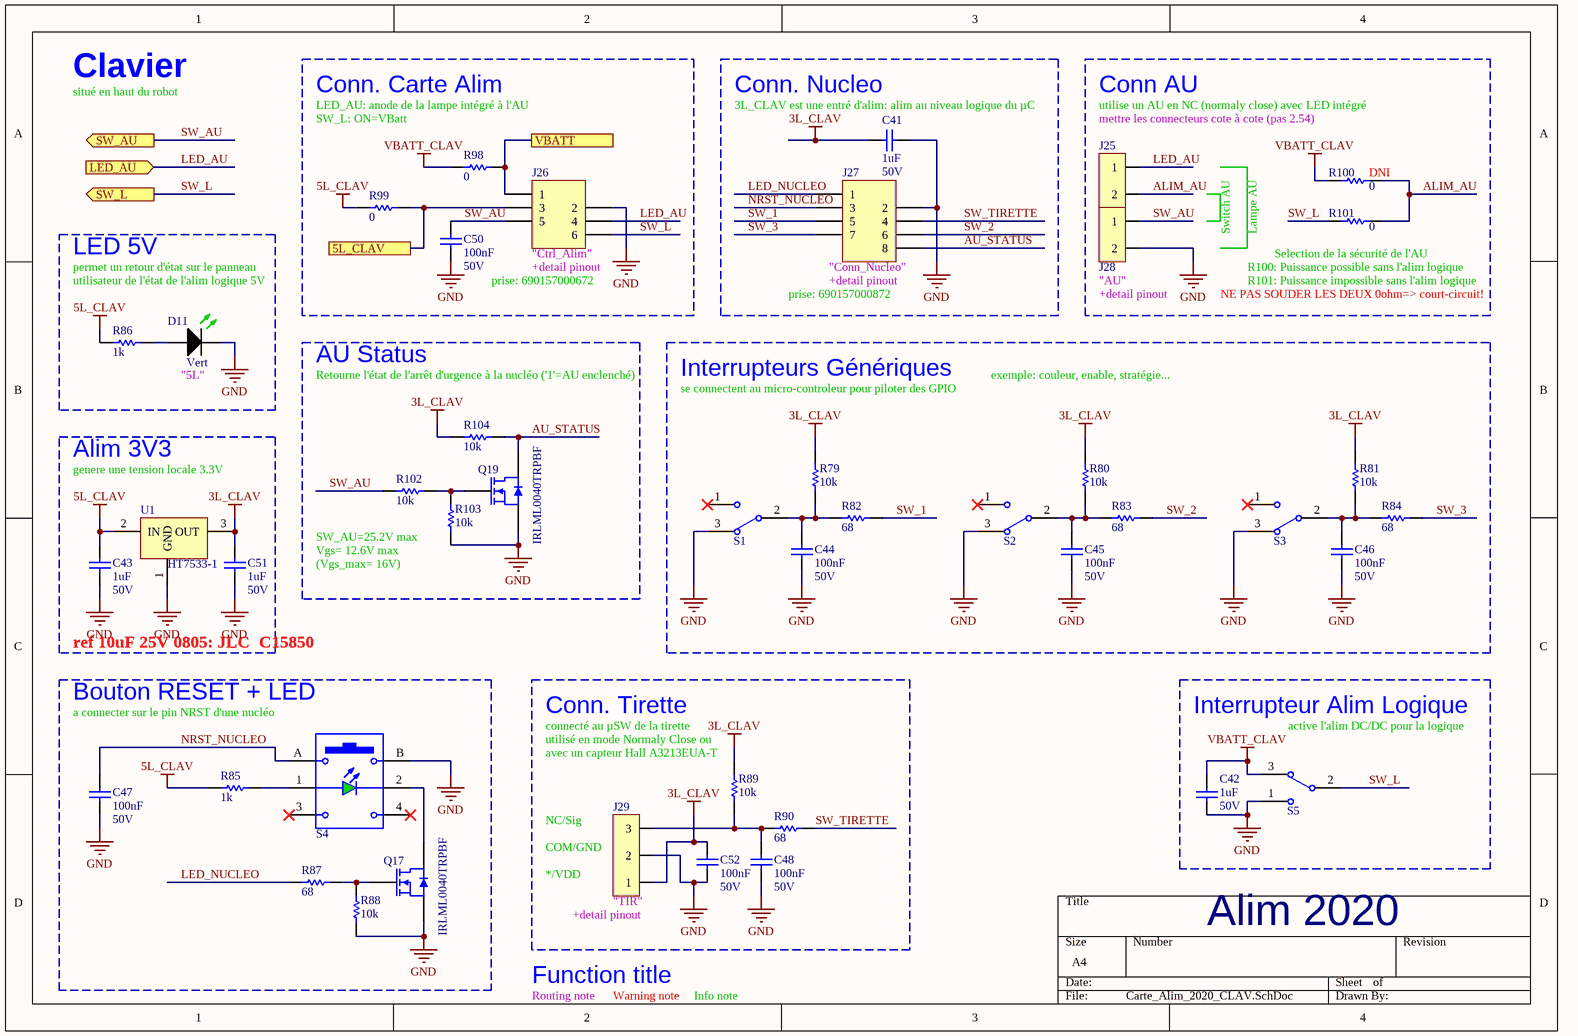
[diagram p2: Carte_Alim_2020_CLAV.SchDoc]

### Parts
C41  1uF  RatedVoltage: 50V  [WCAP-CSGP_0805, 2x1.25x1.25]
C42  1uF  RatedVoltage: 50V  [WCAP-CSGP_0805, 2x1.25x1.25]
C43  1uF  RatedVoltage: 50V  [WCAP-CSGP_0805, 2x1.25x1.25]
C44  100nF  RatedVoltage: 50V  [WCAP-CSGP_0603, 1.6x0.8x0.8]
C45  100nF  RatedVoltage: 50V  [WCAP-CSGP_0603, 1.6x0.8x0.8]
C46  100nF  RatedVoltage: 50V  [WCAP-CSGP_0603, 1.6x0.8x0.8]
C47  100nF  RatedVoltage: 50V  [WCAP-CSGP_0603, 1.6x0.8x0.8]
C48  100nF  RatedVoltage: 50V  [WCAP-CSGP_0603, 1.6x0.8x0.8]
C50  100nF  RatedVoltage: 50V  [WCAP-CSGP_0603, 1.6x0.8x0.8]
C51  1uF  RatedVoltage: 50V  [WCAP-CSGP_0805, 2x1.25x1.25]
C52  100nF  RatedVoltage: 50V  [WCAP-CSGP_0603, 1.6x0.8x0.8]
D11  Vert  [SMCW_0603]
J25  22-03-2021  [22-03-2021]  (value not drawn)
J26  690367280676  [690367280676]  (value not drawn)
J27  690367280876  [690367280876]  (value not drawn)
J28  22-03-2021  [22-03-2021]  (value not drawn)
J29  22-03-2031  [22-03-2031]  (value not drawn)
Q17  IRLML0040TRPBF  [SOT-23]
Q19  IRLML0040TRPBF  [SOT-23]
R79  value 10k  [RESC1608X06N]  (hidden comment: RC0603FR-0710KL)
R80  value 10k  [RESC1608X06N]  (hidden comment: RC0603FR-0710KL)
R81  value 10k  [RESC1608X06N]  (hidden comment: RC0603FR-0710KL)
R82  value 68  [RESC1608X06N]  (hidden comment: RC0603FR-0768RL)
R83  value 68  [RESC1608X06N]  (hidden comment: RC0603FR-0768RL)
R84  value 68  [RESC1608X06N]  (hidden comment: RC0603FR-0768RL)
R85  value 1k  [RESC1608X06N]  (hidden comment: RC0603FR-071KL)
R86  value 1k  [RESC1608X06N]  (hidden comment: RC0603FR-071KL)
R87  value 68  [RESC1608X06N]  (hidden comment: RC0603FR-0768RL)
R88  value 10k  [RESC1608X06N]  (hidden comment: RC0603FR-0710KL)
R89  value 10k  [RESC1608X06N]  (hidden comment: RC0603FR-0710KL)
R90  value 68  [RESC1608X06N]  (hidden comment: RC0603FR-0768RL)
R98  value 0  [RESC1608X06N]  (hidden comment: RC0603FR-070RL)
R99  value 0  [RESC1608X06N]  (hidden comment: RC0603FR-070RL)
R100  value 0  [RESC1608X06N]  (hidden comment: RC0603FR-070RL)
R101  value 0  [RESC1608X06N]  (hidden comment: RC0603FR-070RL)
R102  value 10k  [RESC1608X06N]  (hidden comment: RC0603FR-0710KL)
R103  value 10k  [RESC1608X06N]  (hidden comment: RC0603FR-0710KL)
R104  value 10k  [RESC1608X06N]  (hidden comment: RC0603FR-0710KL)
S1  OS102011MS2QN1  [SW_OS102011MS2QN1]  (value not drawn)
S2  OS102011MS2QN1  [SW_OS102011MS2QN1]  (value not drawn)
S3  OS102011MS2QN1  [SW_OS102011MS2QN1]  (value not drawn)
S4  440GS67082622  [440xx67082622]  (value not drawn)
S5  OS102011MS2QN1  [SW_OS102011MS2QN1]  (value not drawn)
U1  HT7533-1  [SOT89-150P350X160-3N]

### Blocks framed on the sheet
Conn. Carte Alim: C50 J26 R98 R99
Conn. Nucleo: C41 J27
Conn AU: J25 J28 R100 R101
LED 5V: D11 R86
AU Status: Q19 R102-R104
Interrupteurs Génériques: C44-C46 R79-R84 S1-S3
Alim 3V3: C43 C51 U1
Bouton RESET + LED: C47 Q17 R85 R87 R88 S4
Conn. Tirette: C48 C52 J29 R89 R90
Interrupteur Alim Logique: C42 S5

### Ports
5L_CLAV, LED_AU (in), SW_AU (out), SW_L (out), VBATT

### Nets
3L_CLAV: C41.2 C51.1 C52.1 J29.1 R79.2 R80.2 R81.2 R89.2 R104.2 U1.3(OUT)
5L: J26.3 R99.1 ; port 5L_CLAV
5L_CLAV: C43.1 R85.1 R86.1 R99.2 U1.2(IN)
GND: C41.1 C42.1 C43.2 C44.2 C45.2 C46.2 C47.2 C48.2 C50.2 C51.2 C52.2 D11.1(C) J26.2 J27.2 J28.2 J29.2 Q17.2(S) Q19.2(S) R88.1 R103.1 S1.3 S2.3 S3.3 S4.B S5.1 U1.1(GND)
VBATT: J26.1 R98.1 ; port VBATT
VBATT_CLAV: C42.2 R98.2 R100.1 S5.3
ALIM_AU: J25.2 R100.2 R101.2
AU_STATUS: J27.8 Q19.3(D) R104.1
LED_AU: J25.1 J26.4 ; port LED_AU
LED_NUCLEO: J27.1 R87.1
NRST_NUCLEO: C47.1 J27.3 S4.A
SW_1: J27.5 R82.2
SW_2: J27.6 R83.2
SW_3: J27.7 R84.2
SW_AU: C50.1 J26.5 J28.1 R102.2 ; port SW_AU
SW_L: J26.6 R101.1 S5.2 ; port SW_L
SW_TIRETTE: J27.4 R90.2
NetC44_1: C44.1 R79.1 R82.1 S1.2
NetC45_1: C45.1 R80.1 R83.1 S2.2
NetC46_1: C46.1 R81.1 R84.1 S3.2
NetC48_1: C48.1 J29.3 R89.1 R90.1
NetD11_2: D11.2(A) R86.2
NetQ17_1: Q17.1(G) R87.2 R88.2
NetQ17_3: Q17.3(D) S4.2
NetQ19_1: Q19.1(G) R102.1 R103.2
NetR85_2: R85.2 S4.1

Not connected (* = marked no-connect by the designer): S1 1*; S2 1*; S3 1*; S4 3* 4*

### Notes on the sheet
- Clavier
- situé en haut du robot
- LED_AU: anode de la lampe intégré à l'AU
- (near C41) 3L_CLAV est une entré d'alim: alim au niveau logique du µC
- utilise un AU en NC (normaly close) avec LED intégré
- SW_L: ON=VBatt
- mettre les connecteurs cote à cote (pas 2.54)
- (near R100) DNI
- Switch AU
- Lampe AU
- permet un retour d'état sur le panneau
- utilisateur de l'état de l'alim logique 5V
- prise: 690157000672
- (near J26) "Ctrl_Alim"
- (near J26) +detail pinout
- (near J27) prise: 690157000872
- (near J27) "Conn_Nucleo"
- (near J27) +detail pinout
- (near J28) "AU"
- (near J28) +detail pinout
- NE PAS SOUDER LES DEUX 0ohm=> court-circuit!
- (near R101) R100: Puissance possible sans l'alim logique
- R101: Puissance impossible sans l'alim logique
- (near R101) Selection de la sécurité de l'AU
- (near D11) "5L"
- Retourne l'état de l'arrêt d'urgence à la nucléo ('1'=AU enclenché)
- exemple: couleur, enable, stratégie...
- se connectent au micro-controleur pour piloter des GPIO
- genere une tension locale 3.3V
- SW_AU=25.2V max
- Vgs= 12.6V max
- (Vgs_max= 16V)
- ref 10uF 25V 0805: JLC  C15850
- (near S4) a connecter sur le pin NRST d'une nucléo
- (near R89) connecté au µSW de la tirette
- (near R89) utilisé en mode Normaly Close ou
- (near R89) avec un capteur Hall A3213EUA-T
- (near S5) active l'alim DC/DC pour la logique
- (near J29) COM/GND
- NC/Sig
- */VDD
- (near J29) +detail pinout
- (near J29) "TIR"
- Function title
- Alim 2020
- Routing note
- Warning note
- Info note
- Title
- Size:
- Date:
- A4
- Number:
- Time:
- Revision:
- Sheet
- of
- File:

### Library data of the parts
C41-C43 C51 = WCAP-CSGP, 885012207103: as C1 on sheet Carte_Alim_2020_TOP; PublishedDate: Aug 2016; ComponentLink1Description: Manufacturer; ComponentLink1URL: http://www.we-online.de; ComponentLink2Description: Datasheet; ComponentLink2URL: http://katalog.we-online.com/pbs/datasheet/885012207103.pdf; Manufacturer Part Number: 885012207103; Value: 1uF; Size: 0805; CeramicType: X7R
  C43 C51: Supplier 2: JLCPCB; Supplier Part Number 2: C28323
C44-C48 C50 C52 = WCAP-CSGP, 885012206095: as C4 on sheet Carte_Alim_2020_TOP; PublishedDate: Aug 2016; ComponentLink1Description: Manufacturer; ComponentLink1URL: http://www.we-online.de; ComponentLink2Description: Datasheet; ComponentLink2URL: http://katalog.we-online.com/pbs/datasheet/885012206095.pdf; Value: 100nF; Size: 0603; CeramicType: X7R; Manufacturer Part Number: 885012206095
D11 = WL-SMCW 0603  150060GS75000: as D1 on sheet Carte_Alim_2020_TOP; Manufacturer Part Number: 150060GS75000; ComponentLink1Description: Manufacturer; ComponentLink1URL: http://www.we-online.de; Created by: Christin Otto; Created Date: June 2013; ComponentLink2Description: Datasheet; ComponentLink2URL: http://katalog.we-online.com/led/datasheet/150060GS75000.pdf; Color: Green; Value: Vert; Supplier 1: Farnell; Supplier Part Number 1: 2322070
J25 J28 = 22-03-2021: Manufacturer 1: MOLEX; Supplier 1: Farnell; Supplier Part Number 1: 9731075; Manufacturer Part Number: 22-03-2021; Pricing: 10=0.189, 100=0.147, 200=0.119, 500=0.108, 1000=0.088, 2500=0.08, 2500=0.0711, 20000=0.064 (EUR); ComponentLink1URL: http://www.farnell.com/cad/1533907.pdf; ComponentLink1Description: http://www.farnell.com/cad/1533907.pdf; ComponentLink2URL: http://www.farnell.com/datasheets/1791308.pdf; ComponentLink2Description: http://www.farnell.com/datasheets/1791308.pdf
J26 = 690367280676: as J3 on sheet Carte_Alim_2020_TOP; ComponentLink1Description: Datasheet; ComponentLink1URL: http://katalog.we-online.de/em/datasheet/69036728xx76.pdf; Manufacturer Part Number: 690367280676; Supplier 1: Farnell; Supplier Part Number 1: 1641849
J27 = 690367280876: as J16 on sheet Carte_Alim_2020_CAP; Manufacturer Part Number: 690367280876; ComponentLink1Description: Datasheet; ComponentLink1URL: http://katalog.we-online.de/em/datasheet/69036728xx76.pdf; Supplier 1: Farnell; Supplier Part Number 1: 1641850
J29 = 22-03-2031: Manufacturer 1: MOLEX; Supplier 1: Farnell; Supplier Part Number 1: 9731083; Manufacturer Part Number: 22-03-2031; Pricing: 10=0.27, 100=0.242, 200=0.22, 500=0.208, 1000=0.202, 2500=0.196 (EUR); ComponentLink1URL: http://www.farnell.com/cad/1533907.pdf; ComponentLink1Description: http://www.farnell.com/cad/1533907.pdf; ComponentLink2URL: http://www.farnell.com/datasheets/1785732.pdf; ComponentLink2Description: http://www.farnell.com/datasheets/1785732.pdf
Q17 Q19 = IRLML0040: as Q2 on sheet Carte_Alim_2020_TOP; Supplier 1: Farnell; Supplier Part Number 1: 1831088; Manufacturer Part Number: IRLML0040TRPBF; ComponentLink1Description: http://www.irf.com/product-info/datasheets/data/irlml0040pbf.pdf; ComponentLink1URL: http://www.irf.com/product-info/datasheets/data/irlml0040pbf.pdf
R79-R81 R88 R89 R102-R104 = RC0603FR-0710KL: as R1 on sheet Carte_Alim_2020_TOP; Manufacturer Part Number: RC0603FR-0710KL; Type: Thick Film; ComponentLink1Description: Manufacturer; ComponentLink1URL: http://www.yageo.com/NewPortal/_en/index.jsp; ComponentLink2Description: Datasheet; ComponentLink2URL: http://www.farnell.com/datasheets/2167052.pdf; Supplier 1: Farnell; Supplier Part Number 1: 9238603; Precision: ±1%
R82-R84 R87 R90 = RC0603FR-0768RL: as R91 on sheet Carte_Alim_2020_TOP; Manufacturer Part Number: RC0603FR-0768RL; Type: Thick Film; ComponentLink1Description: Manufacturer; ComponentLink1URL: http://www.yageo.com/NewPortal/_en/index.jsp; ComponentLink2Description: Datasheet; ComponentLink2URL: http://www.farnell.com/datasheets/1868787.pdf; Supplier 1: Farnell; Supplier Part Number 1: 9238344; Precision: ±1%
R85 R86 = RC0603FR-071KL: as R7 on sheet Carte_Alim_2020_TOP; Manufacturer Part Number: RC0603FR-071KL; Type: Thick Film; ComponentLink1Description: Manufacturer; ComponentLink1URL: http://www.yageo.com/NewPortal/_en/index.jsp; ComponentLink2Description: Datasheet; ComponentLink2URL: http://www.farnell.com/datasheets/2167052.pdf; Precision: ±1%; Supplier 1: Farnell; Supplier Part Number 1: 9238484
R98-R101 = RC0603FR-070RL: as R92 on sheet Carte_Alim_2020_CAP; ComponentLink1Description: Manufacturer; ComponentLink1URL: http://www.yageo.com/NewPortal/_en/index.jsp; ComponentLink2Description: Datasheet; ComponentLink2URL: http://www.farnell.com/datasheets/2167052.pdf; Manufacturer Part Number: RC0603FR-070RL; Type: Thick Film; Supplier 1: Farnell; Precision: ±1%; Supplier Part Number 1: 2309106; Supplier 2: JLCPCB; Supplier Part Number 2: C21189
S1-S3 S5 = OS102011MS2QN1: SWITCH SLIDE SPDT 0.1A 12V (500VDC max); Manufacturer: C & K COMPONENTS; Supplier 1: Farnell; Supplier Part Number 1: 1201430; Manufacturer Part Number: OS102011MS2QN1; ComponentLink2URL: https://www.ckswitches.com/media/1428/os.pdf; ComponentLink2Description: datasheet; ComponentLink1Description: manufacturer; ComponentLink1URL: https://www.ckswitches.com/products/switches/product-details/Slide/OS/OS102011MS2QN1/
S4 = 440GS67082622: WS-TATL Illuminated THT Tact Switch, Green; Manufacturer: Wurth Elektronik; Operation Force: 220gf; Rated Voltage: 12VDC; Rated Current: 50mA; ComponentLink1Description: Manufacturer; ComponentLink1URL: https://www.we-online.com/catalog/en/TATL_12X12_THT/?sq=440GS67082622#440GS67082622; ComponentLink2Description: Datasheet; ComponentLink2URL: https://katalog.we-online.com/em/datasheet/440GS67082622.pdf; Manufacturer Part Number: 440GS67082622; Emitting Color: Green; Supplier 1: Farnell; Supplier Part Number 1: 2402381
U1 = HT7533-1: LDO 3.3V 100mA SOT89; Manufacturer: Holtek; Manufacturer Part Number: HT7533-1; ComponentLink1URL: https://datasheet.lcsc.com/szlcsc/1812071811_Holtek-Semicon-HT7533-1_C14289.pdf; ComponentLink1Description: Datasheet; ComponentLink2Description: Manufacturer; ComponentLink2URL: https://www.holtek.com/productdetail/-/vg/75xx_1; ContinuousForwardCurrent: 100mA; Type: LDO; Value: 3.3V; Supplier 1: RSComponents; Supplier Part Number 1: 8850721; Supplier 2: JLCPCB; Supplier Part Number 2: C14289

## Nets that join several sheets
5L: Carte_Alim_2020_TOP (J3.3 R12.2), Carte_Alim_2020_CAP (FB8.1), Carte_Alim_2020_CLAV (J26.3 R99.1)
GND: Carte_Alim_2020_TOP (23 pins), Carte_Alim_2020_CAP (36 pins), Carte_Alim_2020_CLAV (26 pins)
PWR: Carte_Alim_2020_TOP (10 pins), Carte_Alim_2020_CAP (FB7.1)
VBATT: Carte_Alim_2020_TOP (13 pins), Carte_Alim_2020_CLAV (J26.1 R98.1)
LED_AU: Carte_Alim_2020_TOP (J3.4 Q6.3 R9.1), Carte_Alim_2020_CLAV (J25.1 J26.4)
SW_AU: Carte_Alim_2020_TOP (J3.5 R3.1), Carte_Alim_2020_CLAV (C50.1 J26.5 J28.1 R102.2)
SW_L: Carte_Alim_2020_TOP (J3.6), Carte_Alim_2020_CLAV (J26.6 R101.1 S5.2)

## Assembly variants
PROD: not fitted C28 FB8 J1 J2 J4 J8 J9 J10 J11 J12 J13 J14 J17 J18 J25 J28 J33 J37 R25 R45 R51 R60 R72 R92 R94 R96 R100
BASE: not fitted C8 C9 C10 C11 C12 C13 C14 C15 C16 C17 C18 C19 C27 C28 D2 D3 D4 D5 D6 D7 DC1 DC2 DC3 FB7 FB8 J1 J2 J4 J5 J6 J7 J8 J9 J10 J11 J12 J13 J14 J17 J18 J25 J28 J31 J32 J33 J37 Q3 Q4 Q5 Q11 Q12 Q13 Q14 Q15 Q16 R17 R18 R19 R20 R21 R22 R23 R24 R25 R26 R55 R56 R57 R58 R59 R60 R61 R62 R63 R64 R65 R66 R67 R68 R69 R70 R71 R72 R73 R74 R75 R76 R77 R78 R92 R93 R94 R95 R96 R97 R100
12V et NPN(VBAT): not fitted C1 C2 C3 C4 C5 C6 C7 C12 C13 C14 C15 C16 C17 C18 C19 C20 C21 C22 C23 C24 C25 C26 C28 C29 C30 C31 C32 C33 C34 C35 C36 C37 C38 C39 C40 C41 C42 C43 C44 C45 C46 C47 C48 C49 C50 D1 D4 D5 D6 D7 D10 D11 D12 D14 DC2 DC3 DT2 F1 F2 FB8 J1 J2 J3 J8 J9 J10 J11 J12 J13 J14 J15 J16 J17 J18 J19 J20 J21 J22 J23 J24 J25 J26 J27 J28 J29 J30 J31 J32 J33 J34 J35 J37 Q1 Q2 Q3 Q5 Q6 Q7 Q8 Q9 Q10 Q17 R1 R2 R3 R4 R5 R6 R7 R8 R9 R10 R11 R12 R13 R14 R15 R16 R21 R22 R23 R24 R25 R26 R27 R28 R29 R30 R31 R32 R33 R34 R35 R36 R37 R38 R39 R40 R41 R42 R43 R44 R45 R46 R47 R48 R49 R50 R51 R52 R53 R54 R79 R80 R81 R82 R83 R84 R85 R86 R87 R88 R89 R90 R92 R94 R96 R98 R99 R100 R101 S1 S2 S3 S4 S5
5L et uSW(VBAT): not fitted C1 C2 C3 C4 C5 C6 C7 C8 C9 C10 C11 C12 C13 C14 C15 C20 C21 C22 C23 C24 C25 C26 C27 C29 C30 C31 C32 C33 C34 C35 C36 C37 C38 C39 C40 C41 C42 C43 C44 C45 C46 C47 C48 C49 C50 D1 D2 D3 D4 D5 D10 D11 D12 D14 DC1 DC2 DT2 F1 F2 FB7 J1 J2 J3 J4 J5 J6 J7 J8 J9 J12 J13 J14 J15 J16 J17 J18 J19 J20 J21 J22 J23 J24 J25 J26 J27 J28 J29 J30 J31 J33 J34 J35 J37 Q1 Q2 Q3 Q4 Q6 Q7 Q8 Q9 Q10 Q17 R1 R2 R3 R4 R5 R6 R7 R8 R9 R10 R11 R12 R13 R14 R15 R16 R17 R18 R19 R20 R21 R22 R23 R27 R28 R29 R30 R31 R32 R33 R34 R35 R36 R37 R38 R39 R40 R41 R42 R43 R44 R45 R46 R47 R48 R49 R50 R51 R52 R53 R54 R58 R59 R60 R70 R71 R72 R79 R80 R81 R82 R83 R84 R85 R86 R87 R88 R89 R90 R93 R95 R97 R98 R99 R100 R101 S1 S2 S3 S4 S5; alternate parts R61 -> RC0603FR-071K8L, R62 -> RC0603FR-071K8L, R63 -> RC0603FR-071K8L, R73 -> RC0603FR-071K8L, R74 -> RC0603FR-071K8L, R75 -> RC0603FR-071K8L
5P et AN(5V): not fitted C1 C2 C3 C4 C5 C6 C7 C8 C9 C10 C11 C16 C17 C18 C19 C20 C21 C22 C23 C24 C25 C26 C27 C29 C30 C31 C32 C33 C34 C35 C36 C37 C38 C39 C40 C41 C42 C43 C44 C45 C46 C47 C48 C49 C50 D1 D2 D3 D6 D7 D10 D11 D12 D14 DC1 DC3 DT2 F1 F2 FB7 J1 J2 J3 J4 J5 J6 J7 J10 J11 J12 J13 J14 J15 J16 J17 J18 J19 J20 J21 J22 J23 J24 J25 J26 J27 J28 J29 J30 J32 J33 J34 J35 J37 Q1 Q2 Q4 Q5 Q6 Q7 Q8 Q9 Q10 Q11 Q12 Q13 Q14 Q15 Q16 Q17 R1 R2 R3 R4 R5 R6 R7 R8 R9 R10 R11 R12 R13 R14 R15 R16 R17 R18 R19 R20 R24 R25 R26 R27 R28 R29 R30 R31 R32 R33 R34 R35 R36 R37 R38 R39 R40 R41 R42 R43 R44 R45 R46 R47 R48 R49 R50 R51 R52 R53 R54 R55 R56 R57 R58 R59 R60 R67 R68 R69 R70 R71 R72 R79 R80 R81 R82 R83 R84 R85 R86 R87 R88 R89 R90 R93 R95 R97 R98 R99 R100 R101 S1 S2 S3 S4 S5